# Altium schematic sheet V3S.SchDoc
size A3; SheetNumber: 7; SheetTotal: 8
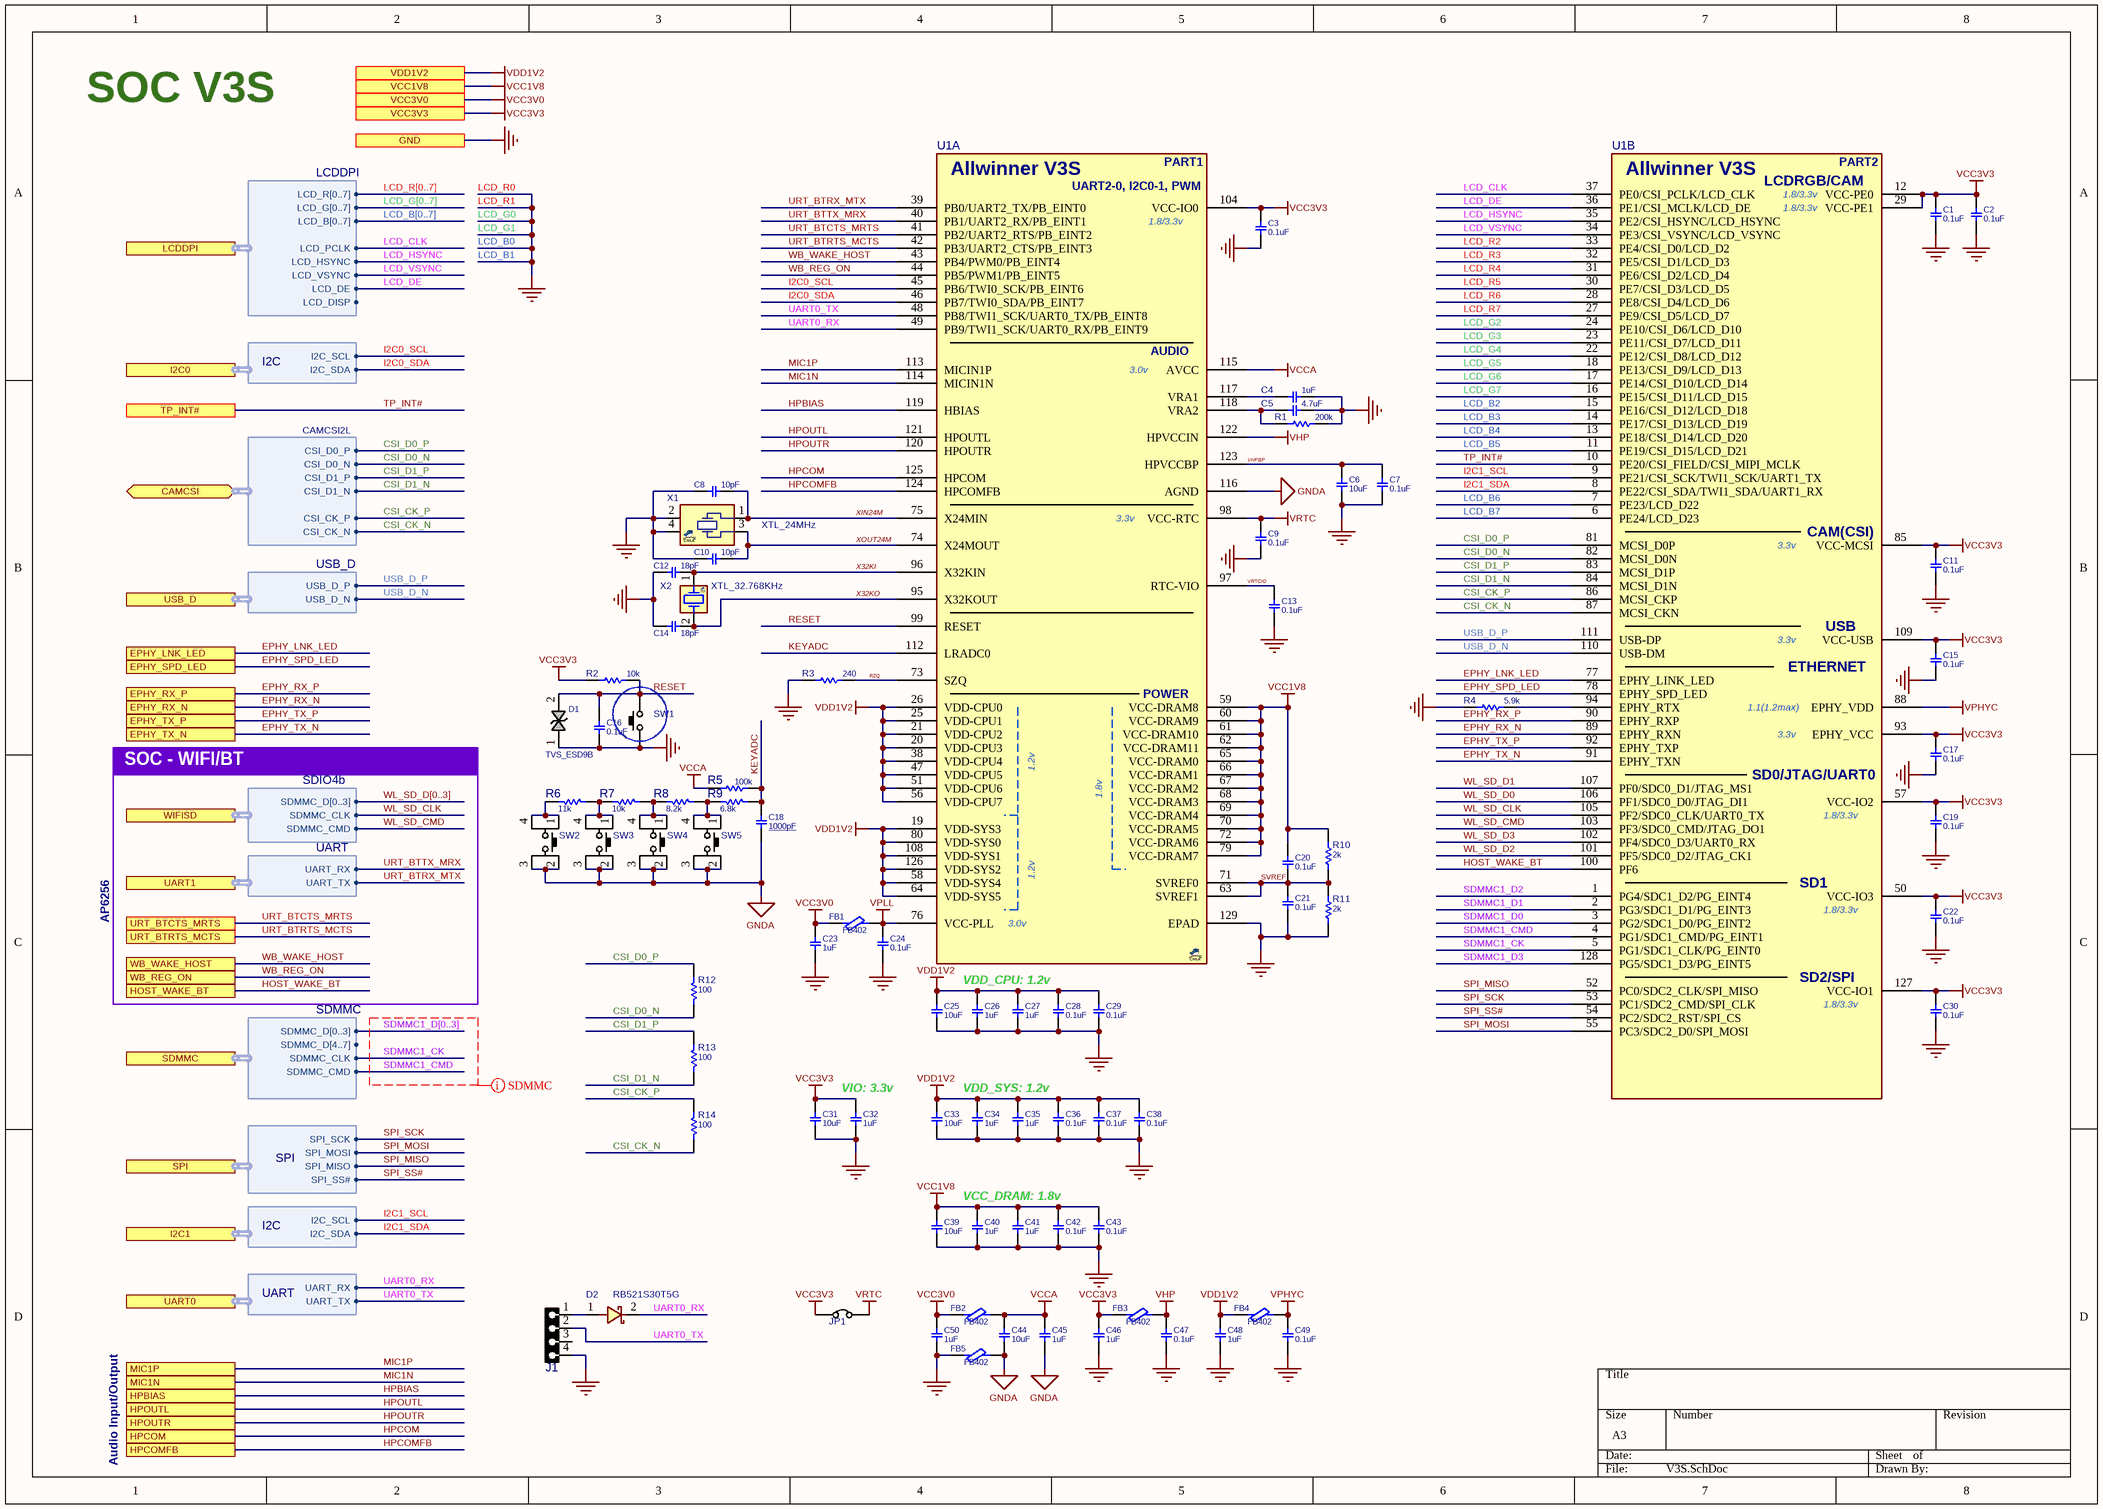
[diagram p0: V3S.SchDoc]

## Parts
C1  0.1uF  [C0402]
C2  0.1uF  [C0402]
C3  0.1uF  [C0402]
C4  1uF  [C0402]
C5  4.7uF  [C0402]
C6  10uF  [C0402]
C7  0.1uF  [C0402]
C8  10pF  [C0402]
C9  0.1uF  [C0402]
C10  10pF  [C0402]
C11  0.1uF  [C0402]
C12  18pF  [C0402]
C13  0.1uF  [C0402]
C14  18pF  [C0402]
C15  0.1uF  [C0402]
C16  0.1uF  [C0402]
C17  0.1uF  [C0402]
C18  1000pF  [C0402]
C19  0.1uF  [C0402]
C20  0.1uF  [C0402]
C21  0.1uF  [C0402]
C22  0.1uF  [C0402]
C23  1uF  [C0402]
C24  0.1uF  [C0402]
C25  10uF  [C0402]
C26  1uF  [C0402]
C27  1uF  [C0402]
C28  0.1uF  [C0402]
C29  0.1uF  [C0402]
C30  0.1uF  [C0402]
C31  10uF  [C0402]
C32  1uF  [C0402]
C33  10uF  [C0402]
C34  1uF  [C0402]
C35  1uF  [C0402]
C36  0.1uF  [C0402]
C37  0.1uF  [C0402]
C38  0.1uF  [C0402]
C39  10uF  [C0402]
C40  1uF  [C0402]
C41  1uF  [C0402]
C42  0.1uF  [C0402]
C43  0.1uF  [C0402]
C44  10uF  [C0402]
C45  1uF  [C0402]
C46  1uF  [C0402]
C47  0.1uF  [C0402]
C48  1uF  [C0402]
C49  0.1uF  [C0402]
C50  1uF  [C0402]
D1  TVS_ESD9B  [D_SOD923]
D2  RB521S30T5G  [D_SOD523]
FB1  FB402  [L0402]
FB2  FB402  [L0402]
FB3  FB402  [L0402]
FB4  FB402  [L0402]
FB5  FB402  [L0402]
J1  HDR1X4  [HDR127MAG_4]  (value not drawn)
JP1  JMPSOLDER  [JP_60X100]  (value not drawn)  (no BOM)
R1  200k  [R0402]
R2  10k  [R0402]
R3  240  [R0402]
R4  5.9k  [R0402]
R5  100k  [R0402]
R6  11k  [R0402]
R7  10k  [R0402]
R8  8.2k  [R0402]
R9  6.8k  [R0402]
R10  2k  [R0402]
R11  2k  [R0402]
R12  100  [R0402]
R13  100  [R0402]
R14  100  [R0402]
SW1  PUSHBUTTON  [SWPBS_SPST_3X2X1]  (value not drawn)
SW2  PUSHBUTTON  [SWPBS_SPDT_R_KMS]  (value not drawn)
SW3  PUSHBUTTON  [SWPBS_SPDT_R_KMS]  (value not drawn)
SW4  PUSHBUTTON  [SWPBS_SPDT_R_KMS]  (value not drawn)
SW5  PUSHBUTTON  [SWPBS_SPDT_R_KMS]  (value not drawn)
U1  Allwinner V3s  [QFG40_128T]  (value not drawn)  (parts A,B of 2)
X1  XTL_24MHz  [XTL_4_2016]
X2  XTL_32.768KHz  [XTL_2_1610]

## Ports
CAMCSI (bidir, harness CAMCSI2L), EPHY_LNK_LED, EPHY_RX_N, EPHY_RX_P, EPHY_SPD_LED, EPHY_TX_N, EPHY_TX_P, GND, HOST_WAKE_BT, HPBIAS, HPCOM, HPCOMFB, HPOUTL, HPOUTR, I2C0 (harness I2C), I2C1 (harness I2C), LCDDPI (harness LCDDPI), MIC1N, MIC1P, SDMMC (harness SDMMC), SPI (harness SPI), TP_INT#, UART0 (harness UART), UART1 (harness UART), URT_BTCTS_MRTS, URT_BTRTS_MCTS, USB_D (harness USB_D), VCC1V8, VCC3V0, VCC3V3, VDD1V2, WB_REG_ON, WB_WAKE_HOST, WIFISD (harness SDIO4b)

## Harnesses
LCDDPI: LCD_PCLK, LCD_HSYNC, LCD_VSYNC, LCD_DE, LCD_R[0..7], LCD_G[0..7], LCD_B[0..7], LCD_DISP
CAMCSI2L: CSI_D0_P, CSI_D0_N, CSI_D1_P, CSI_D1_N, CSI_CK_P, CSI_CK_N
UART: UART_RX, UART_TX
SPI: SPI_SCK, SPI_MOSI, SPI_MISO, SPI_SS#
I2C: I2C_SCL, I2C_SDA
USB_D: USB_D_P, USB_D_N
SDIO4b: SDMMC_CMD, SDMMC_D[0..3], SDMMC_CLK
SDMMC: SDMMC_D[0..3], SDMMC_D[4..7], SDMMC_CLK, SDMMC_CMD

## Nets
GNDA: C18.1 C44.2 C45.2 FB5.2 SW2.2 SW2.3 SW3.2 SW3.3 SW4.2 SW4.3 SW5.2 SW5.3 U1.116(AGND)
LCD_B0: C1.1 C2.1 C3.1 C4.2 C5.2 C6.2 C7.1 C8.2 C9.1 C10.2 C11.1 C12.1 C13.1 C14.1 C15.1 C16.1 C17.1 C19.1 C21.1 C22.1 C23.2 C24.1 C25.2 C26.2 C27.2 C28.1 C29.1 C30.1 C31.2 C32.2 C33.2 C34.2 C35.2 C36.1 C37.1 C38.1 C39.2 C40.2 C41.2 C42.1 C43.1 C46.2 C47.1 C48.2 C49.1 C50.2 D1.1 FB5.1 J1.4 R1.2 R3.2 R4.2 R11.2 SW1.1(P1) U1.129(EPAD) X1.2 X1.4 ; port GND  [also labelled GND, LCD_B1, LCD_G0, LCD_G1, LCD_R0, LCD_R1]
VCC1V8: C20.2 C39.1 C40.1 C41.1 C42.2 C43.2 R10.1 U1.59(VCC-DRAM8) U1.60(VCC-DRAM9) U1.61(VCC-DRAM10) U1.62(VCC-DRAM11) U1.65(VCC-DRAM0) U1.66(VCC-DRAM1) U1.67(VCC-DRAM2) U1.68(VCC-DRAM3) U1.69(VCC-DRAM4) U1.70(VCC-DRAM5) U1.72(VCC-DRAM6) U1.79(VCC-DRAM7) ; port VCC1V8
VCC3V0: C23.1 C50.1 FB1.1 FB2.1 ; port VCC3V0
VCC3V3: C1.2 C2.2 C3.2 C11.2 C15.2 C17.2 C19.2 C22.2 C30.2 C31.1 C32.1 C46.1 FB3.1 JP1.2 R2.2 U1.12(VCC-PE0) U1.29(VCC-PE1) U1.50(VCC-IO3) U1.57(VCC-IO2) U1.85(VCC-MCSI) U1.93(EPHY_VCC) U1.104(VCC-IO0) U1.109(VCC-USB) U1.127(VCC-IO1) ; port VCC3V3
VCCA: C44.1 C45.1 FB2.2 R5.2 U1.115(AVCC)
VDD1V2: C25.1 C26.1 C27.1 C28.2 C29.2 C33.1 C34.1 C35.1 C36.2 C37.2 C38.2 C48.1 FB4.1 U1.19(VDD-SYS3) U1.20(VDD-CPU3) U1.21(VDD-CPU2) U1.25(VDD-CPU1) U1.26(VDD-CPU0) U1.38(VDD-CPU4) U1.47(VDD-CPU5) U1.51(VDD-CPU6) U1.56(VDD-CPU7) U1.58(VDD-SYS4) U1.64(VDD-SYS5) U1.80(VDD-SYS0) U1.108(VDD-SYS1) U1.126(VDD-SYS2) ; port VDD1V2
VHP: C47.2 FB3.2 U1.122(HPVCCIN)
VPHYC: C49.2 FB4.2 U1.88(EPHY_VDD)
VPLL: C24.2 FB1.2 U1.76(VCC-PLL)
VRTC: C9.2 JP1.1 U1.98(VCC-RTC)
CSI_CK_N: R14.1 U1.87(MCSI_CKN) ; port CAMCSI.CSI_CK_N
CSI_CK_P: R14.2 U1.86(MCSI_CKP) ; port CAMCSI.CSI_CK_P
CSI_D0_N: R12.1 U1.82(MCSI_D0N) ; port CAMCSI.CSI_D0_N
CSI_D0_P: R12.2 U1.81(MCSI_D0P) ; port CAMCSI.CSI_D0_P
CSI_D1_N: R13.1 U1.84(MCSI_D1N) ; port CAMCSI.CSI_D1_N
CSI_D1_P: R13.2 U1.83(MCSI_D1P) ; port CAMCSI.CSI_D1_P
EPHY_LNK_LED: U1.77(EPHY_LINK_LED) ; port EPHY_LNK_LED
EPHY_RX_N: U1.89(EPHY_RXN) ; port EPHY_RX_N
EPHY_RX_P: U1.90(EPHY_RXP) ; port EPHY_RX_P
EPHY_SPD_LED: U1.78(EPHY_SPD_LED) ; port EPHY_SPD_LED
EPHY_TX_N: U1.91(EPHY_TXN) ; port EPHY_TX_N
EPHY_TX_P: U1.92(EPHY_TXP) ; port EPHY_TX_P
HOST_WAKE_BT: U1.100(PF6) ; port HOST_WAKE_BT
HPBIAS: U1.119(HBIAS) ; port HPBIAS
HPCOM: U1.125(HPCOM) ; port HPCOM
HPCOMFB: U1.124(HPCOMFB) ; port HPCOMFB
HPOUTL: U1.121(HPOUTL) ; port HPOUTL
HPOUTR: U1.120(HPOUTR) ; port HPOUTR
I2C0_SCL: U1.45(PB6/TWI0_SCK/PB_EINT6) ; port I2C0.I2C_SCL
I2C0_SDA: U1.46(PB7/TWI0_SDA/PB_EINT7) ; port I2C0.I2C_SDA
I2C1_SCL: U1.9(PE21/CSI_SCK/TWI1_SCK/UART1_TX) ; port I2C1.I2C_SCL
I2C1_SDA: U1.8(PE22/CSI_SDA/TWI1_SDA/UART1_RX) ; port I2C1.I2C_SDA
KEYADC: C18.2 R5.1 R9.1 U1.112(LRADC0)
LCD_B2: U1.15(PE16/CSI_D12/LCD_D18)
LCD_B3: U1.14(PE17/CSI_D13/LCD_D19)
LCD_B4: U1.13(PE18/CSI_D14/LCD_D20)
LCD_B5: U1.11(PE19/CSI_D15/LCD_D21)
LCD_B6: U1.7(PE23/LCD_D22)
LCD_B7: U1.6(PE24/LCD_D23)
LCD_CLK: U1.37(PE0/CSI_PCLK/LCD_CLK) ; port LCDDPI.LCD_PCLK
LCD_DE: U1.36(PE1/CSI_MCLK/LCD_DE) ; port LCDDPI.LCD_DE
LCD_G2: U1.24(PE10/CSI_D6/LCD_D10)
LCD_G3: U1.23(PE11/CSI_D7/LCD_D11)
LCD_G4: U1.22(PE12/CSI_D8/LCD_D12)
LCD_G5: U1.18(PE13/CSI_D9/LCD_D13)
LCD_G6: U1.17(PE14/CSI_D10/LCD_D14)
LCD_G7: U1.16(PE15/CSI_D11/LCD_D15)
LCD_HSYNC: U1.35(PE2/CSI_HSYNC/LCD_HSYNC) ; port LCDDPI.LCD_HSYNC
LCD_R2: U1.33(PE4/CSI_D0/LCD_D2)
LCD_R3: U1.32(PE5/CSI_D1/LCD_D3)
LCD_R4: U1.31(PE6/CSI_D2/LCD_D4)
LCD_R5: U1.30(PE7/CSI_D3/LCD_D5)
LCD_R6: U1.28(PE8/CSI_D4/LCD_D6)
LCD_R7: U1.27(PE9/CSI_D5/LCD_D7)
LCD_VSYNC: U1.34(PE3/CSI_VSYNC/LCD_VSYNC) ; port LCDDPI.LCD_VSYNC
MIC1N: U1.114(MICIN1N) ; port MIC1N
MIC1P: U1.113(MICIN1P) ; port MIC1P
RESET: C16.2 D1.2 R2.1 SW1.2(P3) U1.99(RESET)
RZQ: R3.1 U1.73(SZQ)
SDMMC1_CK: U1.5(PG1/SDC1_CLK/PG_EINT0) ; port SDMMC.SDMMC_CLK
SDMMC1_CMD: U1.4(PG1/SDC1_CMD/PG_EINT1) ; port SDMMC.SDMMC_CMD
SDMMC1_D0: U1.3(PG2/SDC1_D0/PG_EINT2)
SDMMC1_D1: U1.2(PG3/SDC1_D1/PG_EINT3)
SDMMC1_D2: U1.1(PG4/SDC1_D2/PG_EINT4)
SDMMC1_D3: U1.128(PG5/SDC1_D3/PG_EINT5)
SPI_MISO: U1.52(PC0/SDC2_CLK/SPI_MISO) ; port SPI.SPI_MISO
SPI_MOSI: U1.55(PC3/SDC2_D0/SPI_MOSI) ; port SPI.SPI_MOSI
SPI_SCK: U1.53(PC1/SDC2_CMD/SPI_CLK) ; port SPI.SPI_SCK
SPI_SS#: U1.54(PC2/SDC2_RST/SPI_CS) ; port SPI.SPI_SS#
SVREF: C20.1 C21.2 R10.2 R11.1 U1.63(SVREF1) U1.71(SVREF0)
TP_INT#: U1.10(PE20/CSI_FIELD/CSI_MIPI_MCLK) ; port TP_INT#
UART0_RX: D2.2 U1.49(PB9/TWI1_SCK/UART0_RX/PB_EINT9) ; port UART0.UART_RX
UART0_TX: J1.2 U1.48(PB8/TWI1_SCK/UART0_TX/PB_EINT8) ; port UART0.UART_TX
URT_BTCTS_MRTS: U1.41(PB2/UART2_RTS/PB_EINT2) ; port URT_BTCTS_MRTS
URT_BTRTS_MCTS: U1.42(PB3/UART2_CTS/PB_EINT3) ; port URT_BTRTS_MCTS
URT_BTRX_MTX: U1.39(PB0/UART2_TX/PB_EINT0) ; port UART1.UART_TX
URT_BTTX_MRX: U1.40(PB1/UART2_RX/PB_EINT1) ; port UART1.UART_RX
USB_D_N: U1.110(USB-DM) ; port USB_D.USB_D_N
USB_D_P: U1.111(USB-DP) ; port USB_D.USB_D_P
VHPBP: C6.1 C7.2 U1.123(HPVCCBP)
VRTCIO: C13.2 U1.97(RTC-VIO)
WB_REG_ON: U1.44(PB5/PWM1/PB_EINT5) ; port WB_REG_ON
WB_WAKE_HOST: U1.43(PB4/PWM0/PB_EINT4) ; port WB_WAKE_HOST
WL_SD_CLK: U1.105(PF2/SDC0_CLK/UART0_TX) ; port WIFISD.SDMMC_CLK
WL_SD_CMD: U1.103(PF3/SDC0_CMD/JTAG_DO1) ; port WIFISD.SDMMC_CMD
WL_SD_D0: U1.106(PF1/SDC0_D0/JTAG_DI1)
WL_SD_D1: U1.107(PF0/SDC0_D1/JTAG_MS1)
WL_SD_D2: U1.101(PF5/SDC0_D2/JTAG_CK1)
WL_SD_D3: U1.102(PF4/SDC0_D3/UART0_RX)
X32KI: C12.2 U1.96(X32KIN) X2.1(OSC1)
X32KO: C14.2 U1.95(X32KOUT) X2.2(OSC2)
XIN24M: C8.1 U1.75(X24MIN) X1.1
XOUT24M: C10.1 U1.74(X24MOUT) X1.3
NetC4_1: C4.1 U1.117(VRA1)
NetC5_1: C5.1 R1.1 U1.118(VRA2)
NetD2_1: D2.1 J1.1
NetR4_1: R4.1 U1.94(EPHY_RTX)
NetR6_1: R6.1 R7.2 SW3.1 SW3.4
NetR6_2: R6.2 SW2.1 SW2.4
NetR7_1: R7.1 R8.2 SW4.1 SW4.4
NetR8_1: R8.1 R9.2 SW5.1 SW5.4

Not connected (* = marked no-connect by the designer): J1 3

## Buses and harness runs
bus LCD_B[0..7]
bus LCD_G[0..7]
bus LCD_R[0..7]
bus SDMMC1_D[0..3]
bus WL_SD_D[0..3]

## Layout directives
net class SDMCU: SDMMC1_CK, SDMMC1_CMD, SDMMC1_D[0..3]

## Notes on the sheet
- SOC V3S
- SOC - WIFI/BT
- AP6256
- VDD_CPU: 1.2v
- (near C32) VIO: 3.3v
- VDD_SYS: 1.2v
- VCC_DRAM: 1.8v
- Audio Input/Output
- (in symbol V3S_QFP128, part A) PART1; Allwinner V3S; UART2-0, I2C0-1, PWM; 1.8/3.3v; AUDIO; 3.0v; 3.3v; POWER; 1.2v; 1.8v
- (in symbol V3S_QFP128, part B) PART2; Allwinner V3S; LCDRGB/CAM; 1.8/3.3v; CAM(CSI); 3.3v; USB; ETHERNET; 1.1(1.2max); SD0/JTAG/UART0; SD1; SD2/SPI

## Library data of the parts
C1-C3 C7 C9 C11 C13 C15 C17 C19-C22 C24 C28-C30 C36-C38 C42 C43 C47 C49 = CAP_SMD_MLCC: CAP, MLCC; PARAM: X7R, 10%, -55~125oC; MANF_P#: GRM155R71H104KE14D; MANF: Murata; PARAM2: 50v; PRICE: 100: 0.018$; ASSEMBLY: ASSEMBLY; VALUE: 0.1uF
C4 C23 C26 C27 C32 C34 C35 C40 C41 C45 C46 C48 C50 = CAP_SMD_MLCC: CAP, MLCC; PARAM: X5R, 10%; MANF_P#: GMK105ABJ105KV-F; MANF: Taiyo Yuden; PARAM2: 35v; PRICE: 100: 0.06$; ASSEMBLY: ASSEMBLY; VALUE: 1uF
C5 = CAP_SMD_MLCC: CAP, MLCC; PARAM: X5R, 20%; MANF_P#: LMK105BBJ475MVLF; MANF: Taiyo Yuden; PARAM2: 10v; PRICE: 10,000: $0.034; ASSEMBLY: ASSEMBLY; VALUE: 4.7uF
C6 C25 C31 C33 C39 C44 = CAP_SMD_MLCC: CAP, MLCC; PARAM: X5R, 10%; MANF_P#: GRM155R60J106ME15; MANF: Murata; PARAM2: 6.3v; PRICE: 10,000: $0.034; ASSEMBLY: ASSEMBLY; VALUE: 10uF
C8 C10 = CAP_SMD_MLCC: CAP, MLCC; PARAM: C0G, 5%; MANF_P#: CC0402JRNPO9BN180; MANF: Yageo; PARAM2: 50v; PRICE: 100: 0.009$; ASSEMBLY: ASSEMBLY; VALUE: 10pF
C12 C14 = CAP_SMD_MLCC: CAP, MLCC; PARAM: C0G; MANF_P#: CC0402CRNPO9BN3R3; MANF: YAGEO; PARAM2: 25v; PRICE: 10,000:	$0.006; ASSEMBLY: ASSEMBLY; VALUE: 18pF
C16 = CAP_SMD_MLCC: CAP, MLCC; PARAM: X5R, 10%; MANF_P#: CL03A104KP3NNWC; MANF: Samsung; PARAM2: 10v; PRICE: 10,000:$0.006; ASSEMBLY: ASSEMBLY; VALUE: 0.1uF
C18 = CAP_SMD_MLCC_0603: CAP, MLCC; PARAM: -, -%; MANF_P#: MANF_PART#; PARAM2: -V; PRICE: 100= 1$; MANF: -; ASSEMBLY: ASSEMBLY; VALUE: 1000pF
D1 = TVS_ESD9B3.3: TVS, ESD PROTECT, Bidirectional; MANF_P#: ESD9B3.3ST5G; MANF: ON; PARAM: 3.3VRWM; VALUE: TVS_ESD9B
D2 = DIODE_SMD_SCHOTTKY_1N5819: DIODE, SCHOTTKY; MANF: DIODES; DESC: DESCRIPTION; PARAM2: 0.2A; PARAM: 30V; MANF_P#: RB521S30T5G; ASSEMBLY: ASSEMBLY; PRICE: PRICE; VALUE: RB521S30T5G
FB1-FB5 = FBEAD_SMD_BLM15PD121: FERRITE_Bead, 0402, 0.5A, 200mOhm, 120@100MHz; MANF: MURATA; MANF_P#: BLM15AG121SN1D; PARAM: 120@100MHz; PARAM2: 0.5A, 200mOhm; VALUE: FB402
J1 = HDRMINI_F_1X4: CONN, HEADER, Female, pitch: 1.27mm, 4POS; VALUE: HDRMINI_4
JP1 = JUMPER_SOLDER: JUMPER, HEADER 2PIN; MANF: MANF; MANF_P#: MANF_P#; VALUE: JMPSOLDER
R1-R4 R10-R14 = RES_SMD: RESISTOR, SMD; PARAM: 0.063W; DESC: DESCRIPTION; DIST#: MOUSER; PARAM2: 1%; MANF_P#: -; MANF: -; ASSEMBLY: ASSEMBLY; PRICE: 100= 0.3$
  R1: VALUE: 200k
  R2: VALUE: 10k
  R3: VALUE: 240
  R4: VALUE: 5.9k
  R10 R11: VALUE: 2k
  R12-R14: VALUE: 100
R5-R9 = RES_SMD_0603: RESISTOR, SMD; PARAM: -W; DESC: DESCRIPTION; DIST#: MOUSER; PARAM2: 1%; MANF_P#: -; MANF: -; ASSEMBLY: ASSEMBLY; PRICE: 100= 0.5$
  R5: VALUE: 100k
  R6: VALUE: 11k
  R7: VALUE: 10k
  R8: VALUE: 8.2k
  R9: VALUE: 6.8k
SW1 = SWPBS_SPST_3X2_B3U-1000P: SWITCH, PUSH BUTTON, TACTILE, SMD, SPST, 3X2.5X1.2mm; MANF: OMRON; DESC: DESCRIPTION; VALUE: PUSHBUTTON; ASSEMBLY: ASSEMBLY; PARAM: PARAM; PRICE: 1$; MANF_P#: B3U-1000P
SW2-SW5 = SWPBS_SPDT_R_CK: SWITCH, PUSH BUTTON, TACTILE, THD, SPDT, RIGHT; PARAM: 50mA/32VDC; DESC: DESCRIPTION; MANF_P#: SKSCPCE010, ST-1186BE, GT-TC045A-H036-L1A, TS-1085S-B3, GT-TC045B-H036-L1A, EVQP7C01P, SKSCLDE010, EVQP7C01P, GT-TC041B-H036-L1N, GT-TC041A-H036-L1A, GT-TC047B-H016-L1A, KMS221GLFS; MANF: -; VALUE: PUSHBUTTON; ASSEMBLY: ASSEMBLY; PRICE: 0.07$
U1 = V3S_QFP128: processor, Cortex-A7 1.2GHz w 512Mb DDR2; MANF: Allwinner; MANF_P#: V3s; PARAM: Cortex-A7 1.2GHz w 512Mb DDR2; VALUE: Allwinner V3s
X1 = XTL_4_40MHz_3225A: CRYSTAL; MANF: Murata; PARAM: -20~70oC; DIST#: MOUSER; PARAM2: 10PPM, 6pF; ASSEMBLY: ASSEMBLY; PRICE: 0.4$; MANF_P#: -; VALUE: XTL_24MHz
X2 = XTL_2_32.768_3215A: Crystal; MANF_P#: ABS05-32.768KHZ-9-T; PARAM2: 7pF, 20PPM; PARAM: -40~85oC; MANF: -; PRICE: 1$; VALUE: XTL_32.768KHz